# Altium schematic sheet V72单CIS.SchDoc
size A1
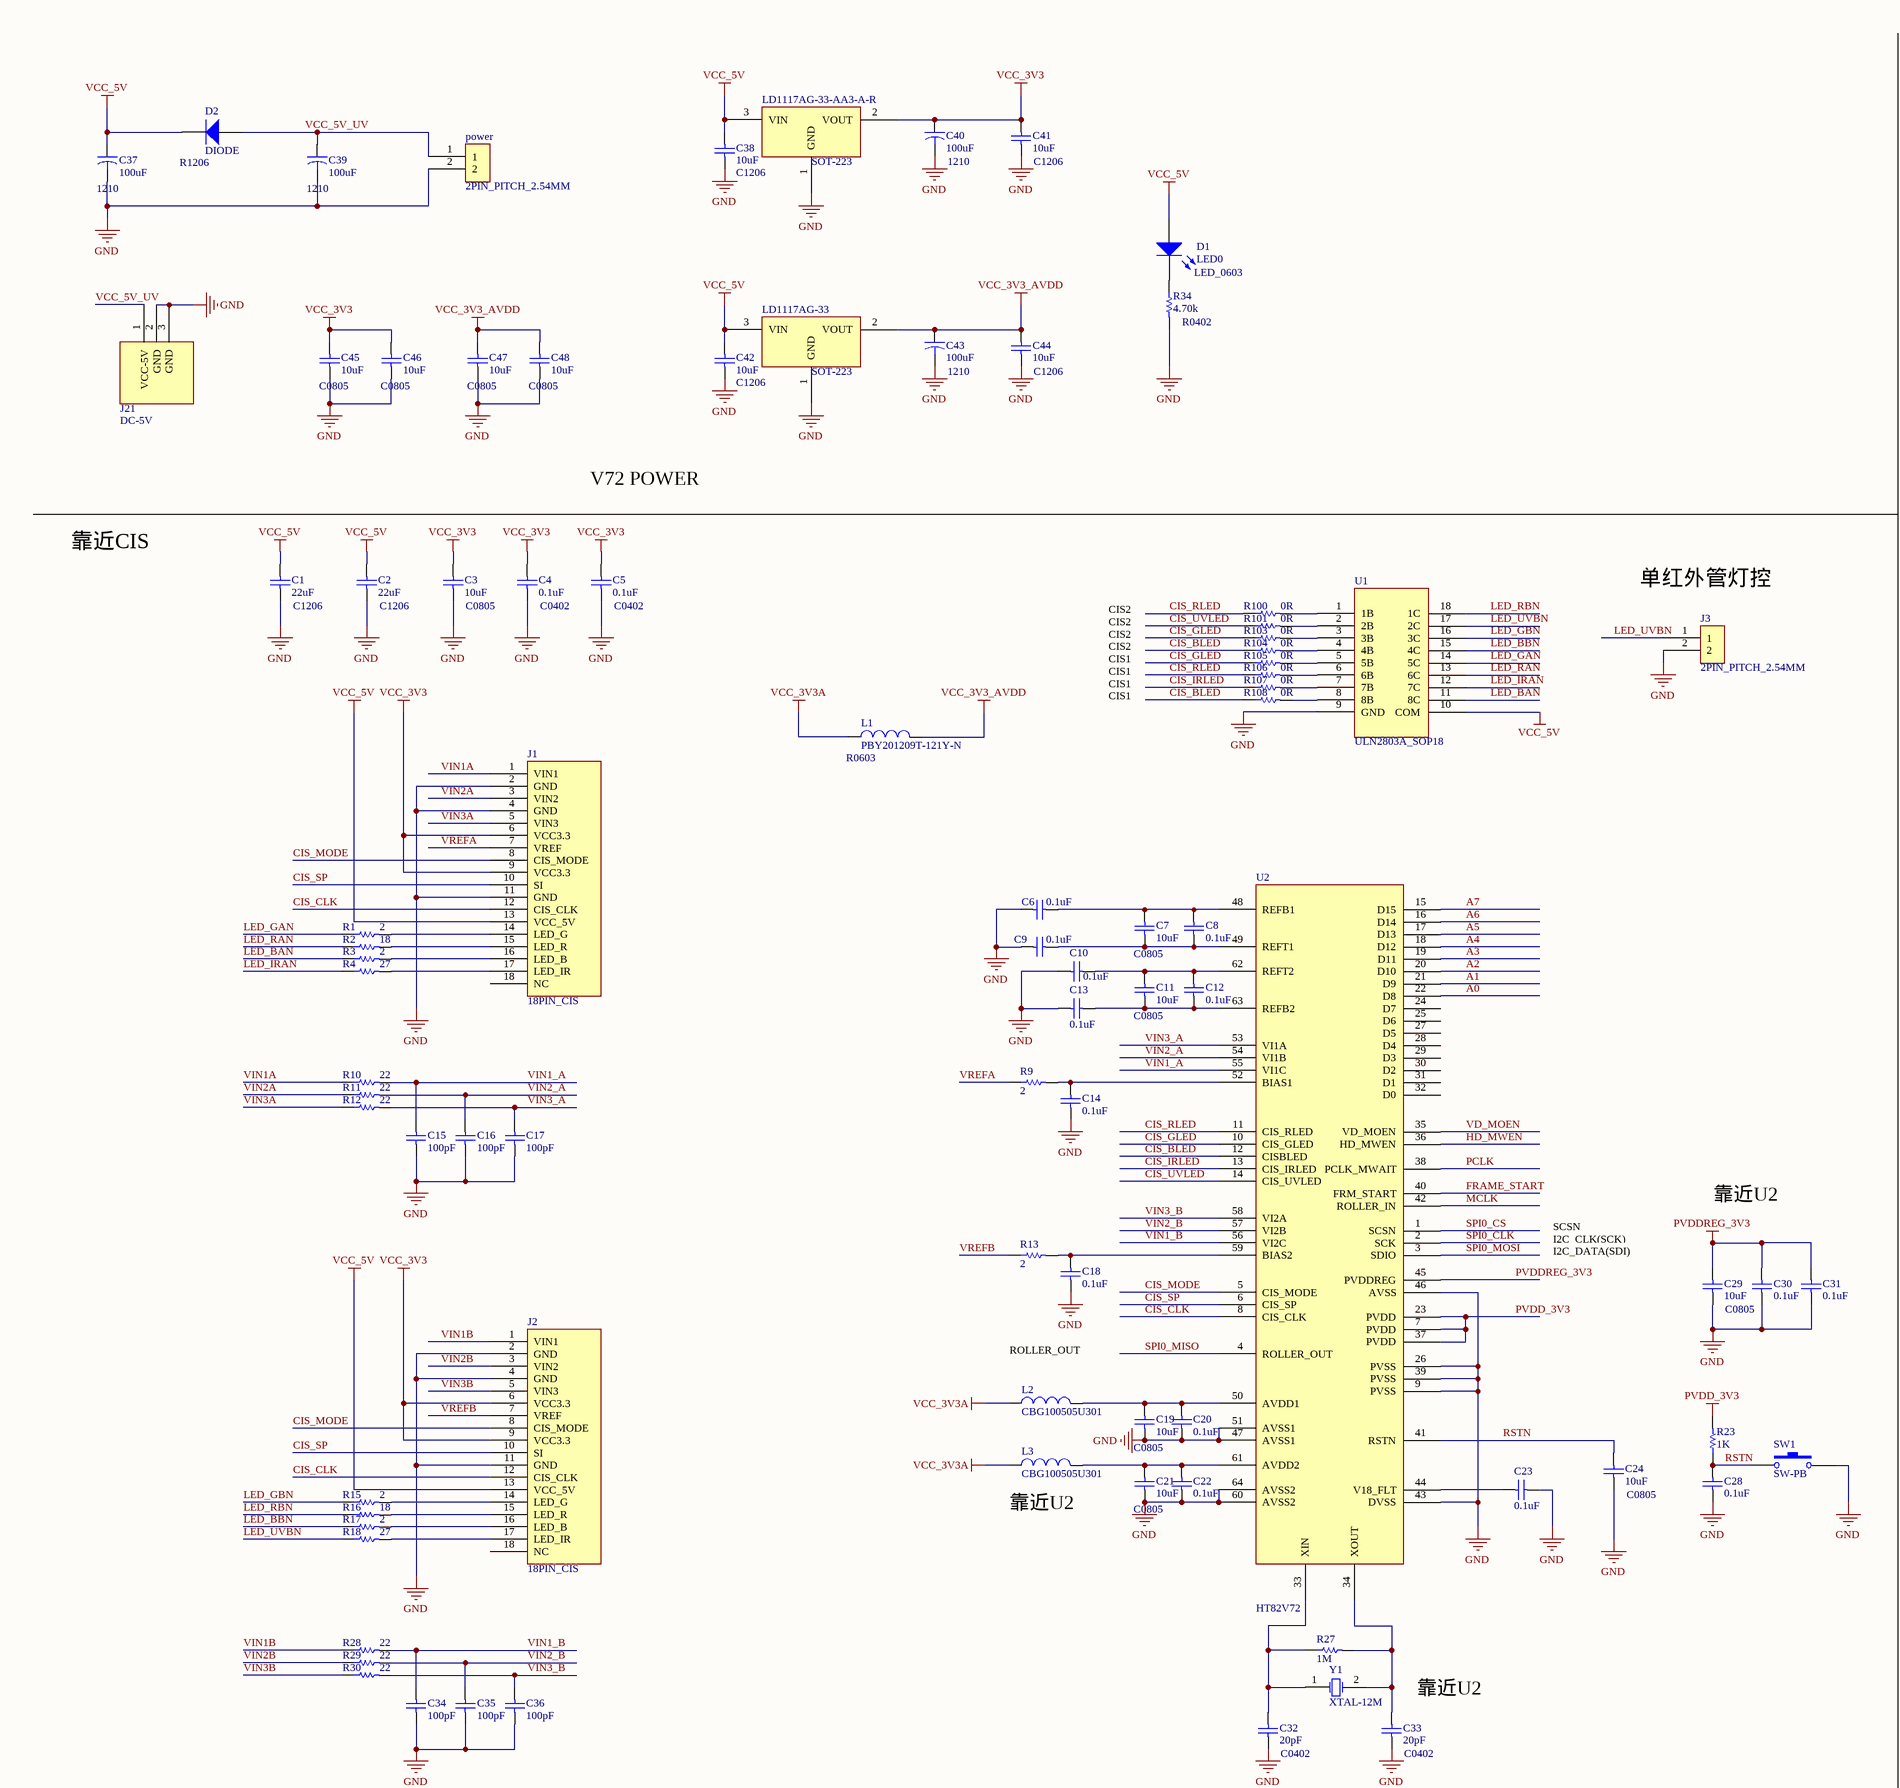
[diagram p0: V72单CIS.SchDoc, top left]
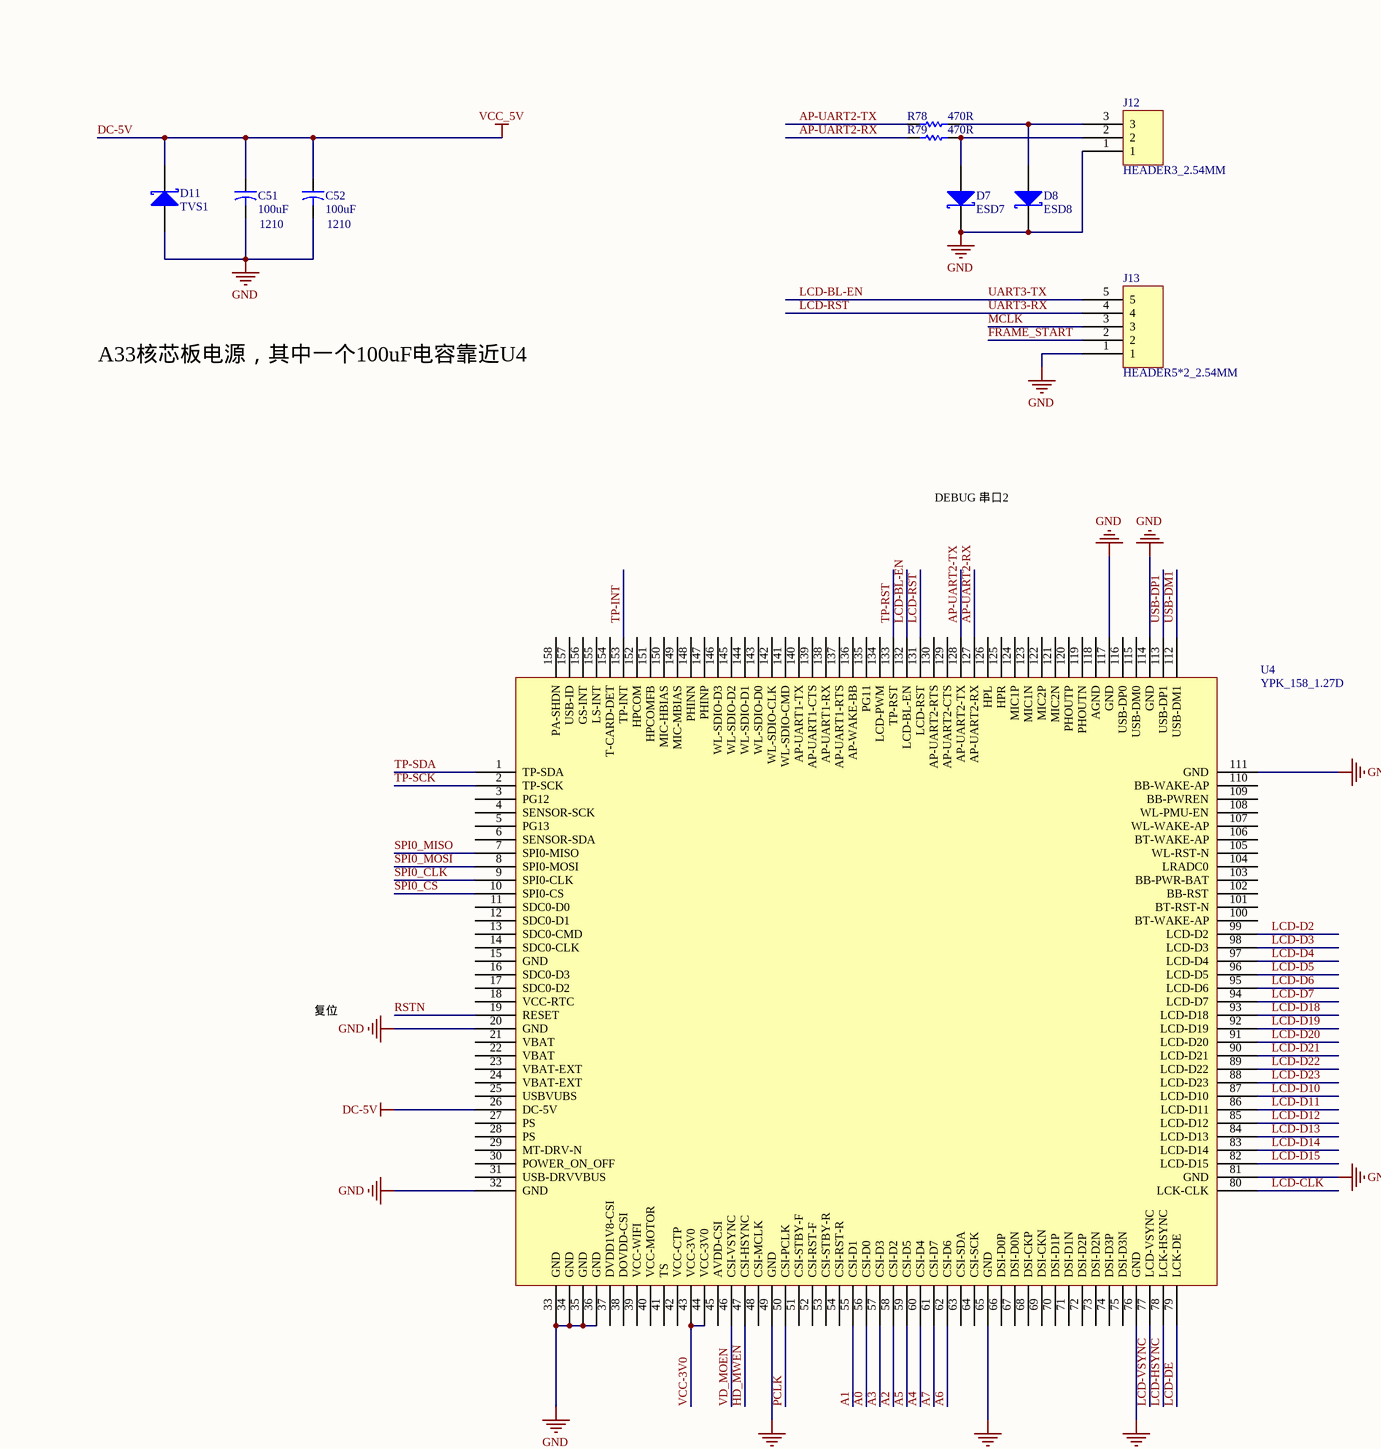
[diagram p1: V72单CIS.SchDoc, top middle]
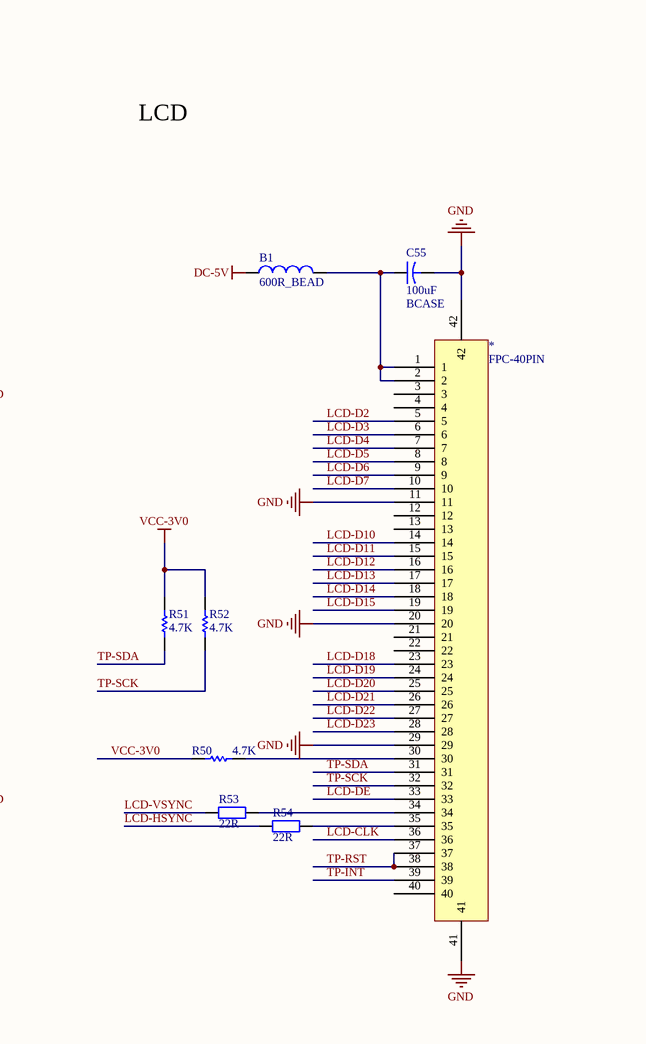
[diagram p2: V72单CIS.SchDoc, top right]
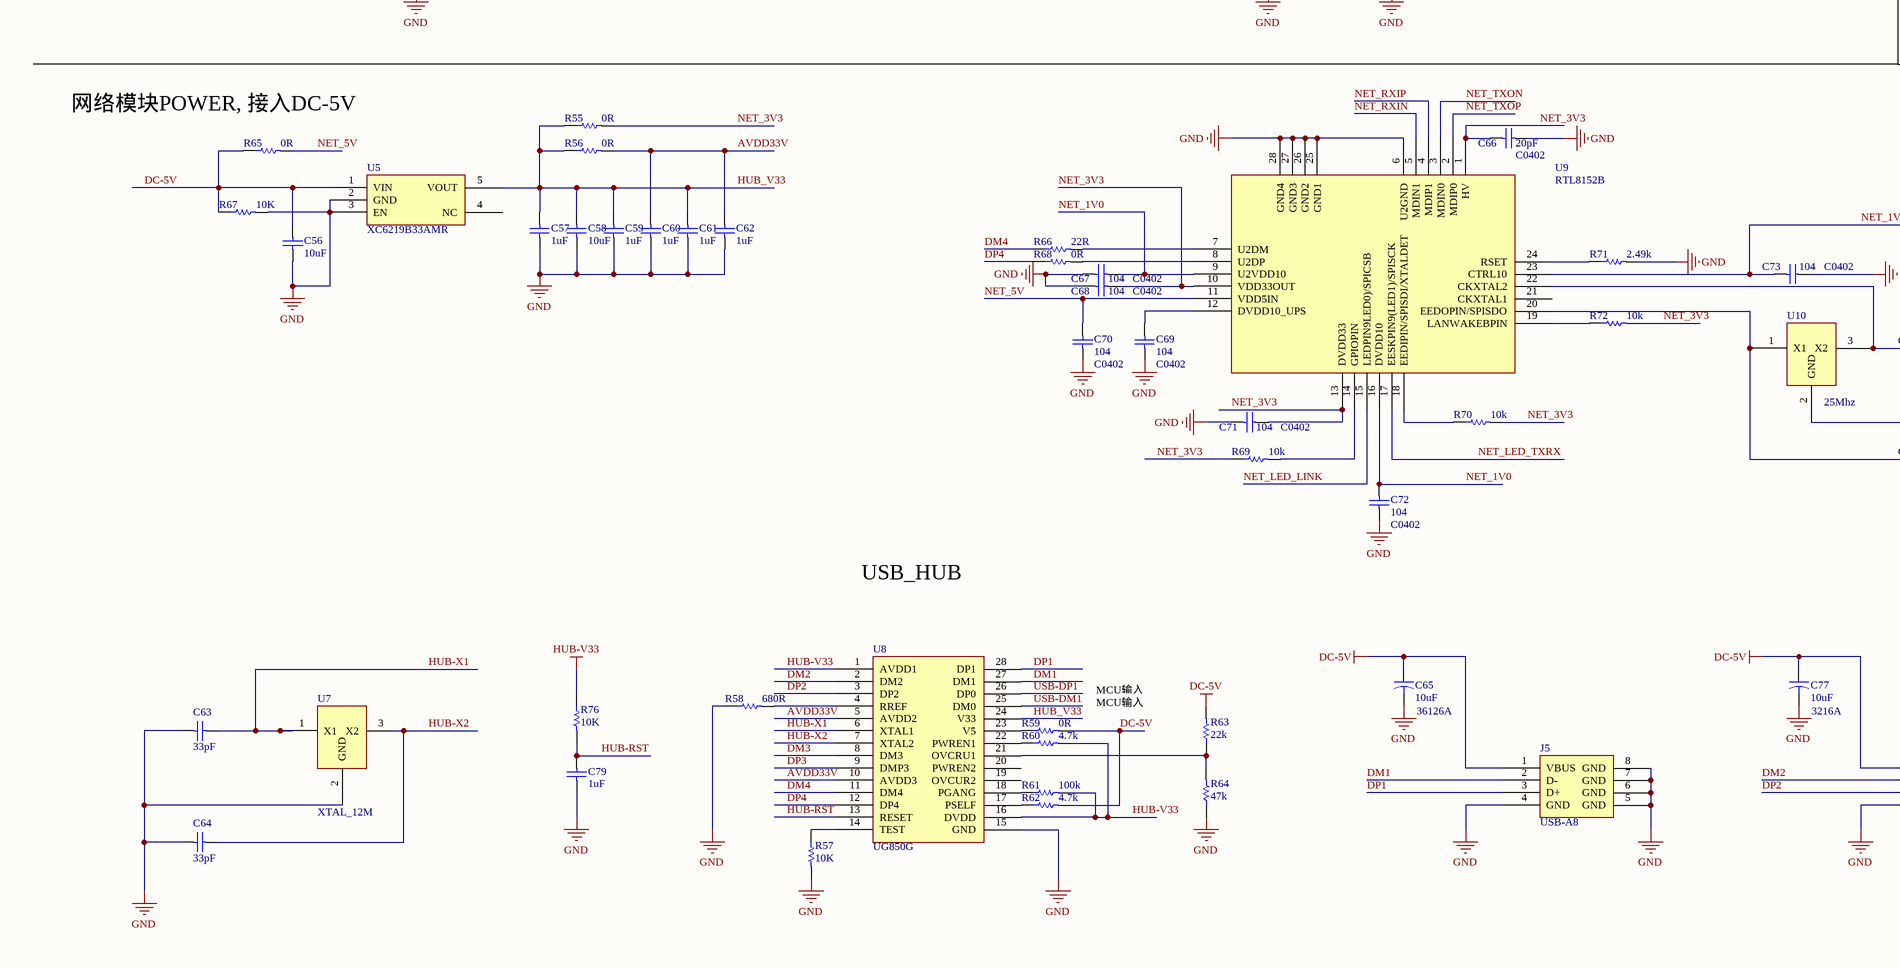
[diagram p3: V72单CIS.SchDoc, bottom left]
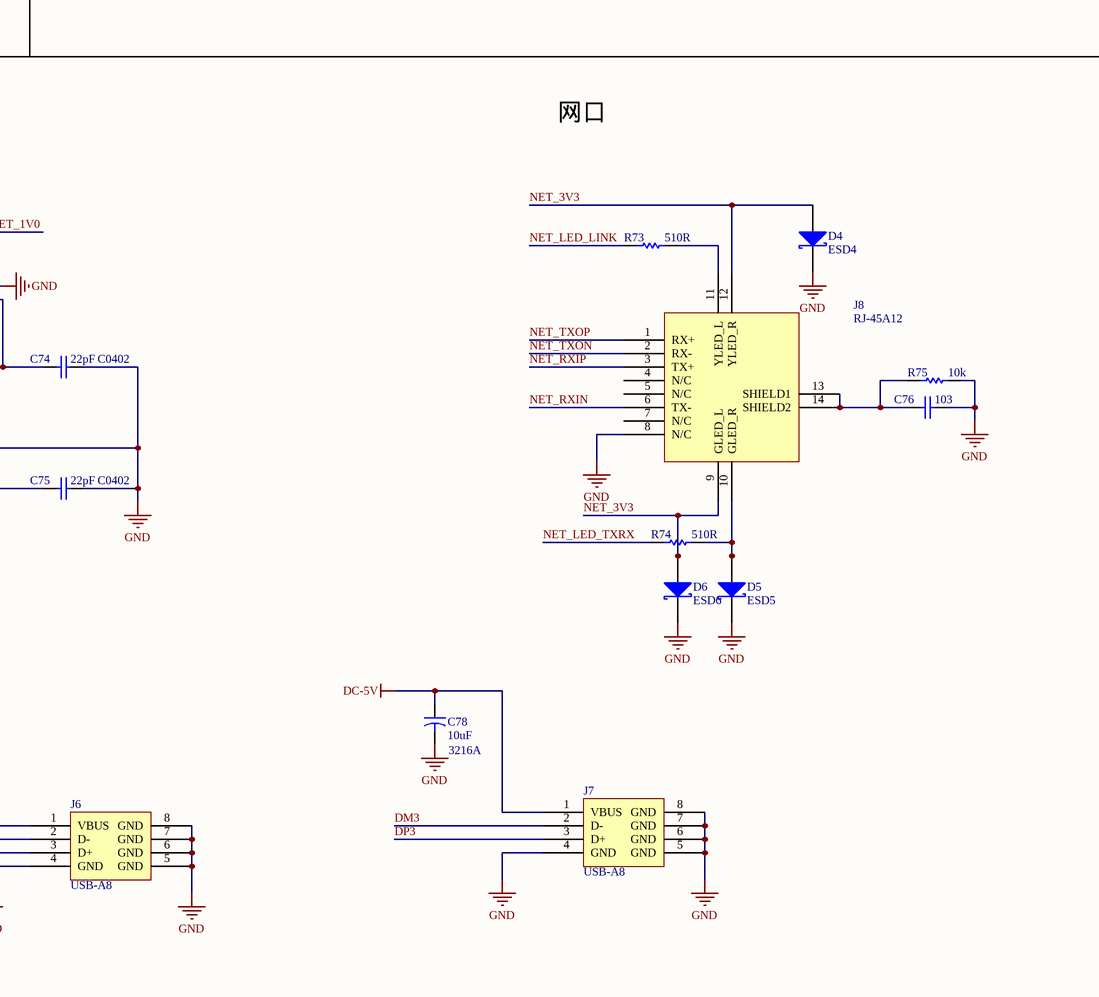
[diagram p4: V72单CIS.SchDoc, bottom middle]

## Parts
*  FPC-40PIN  [FPC-40PIN]
B1  600R_BEAD  [R0603]
C1  22uF  [C1206]
C2  22uF  [C1206]
C3  10uF  [C0805]
C4  0.1uF  [C0402]
C5  0.1uF  [C0402]
C6  0.1uF  [C0402]
C7  10uF  [C0805]
C8  0.1uF  [C0402]
C9  0.1uF  [C0402]
C10  0.1uF  [C0402]
C11  10uF  [C0805]
C12  0.1uF  [C0402]
C13  0.1uF  [C0402]
C14  0.1uF  [C0402]
C15  100pF  [C0402]
C16  100pF  [C0402]
C17  100pF  [C0402]
C18  0.1uF  [C0402]
C19  10uF  [C0805]
C20  0.1uF  [C0402]
C21  10uF  [C0805]
C22  0.1uF  [C0402]
C23  0.1uF  [C0402]
C24  10uF  [C0805]
C28  0.1uF  [C0402]
C29  10uF  [C0805]
C30  0.1uF  [C0402]
C31  0.1uF  [C0402]
C32  20pF  [C0402]
C33  20pF  [C0402]
C34  100pF  [C0402]
C35  100pF  [C0402]
C36  100pF  [C0402]
C37  100uF  [1210]
C38  10uF  [C1206]
C39  100uF  [1210]
C40  100uF  [1210]
C41  10uF  [C1206]
C42  10uF  [C1206]
C43  100uF  [1210]
C44  10uF  [C1206]
C45  10uF  [C0805]
C46  10uF  [C0805]
C47  10uF  [C0805]
C48  10uF  [C0805]
C51  100uF  [1210]
C52  100uF  [1210]
C55  100uF  [BCASE]
C56  10uF  [0603A]
C57  1uF  [0603A]
C58  10uF  [0603A]
C59  1uF  [0603A]
C60  1uF  [0603A]
C61  1uF  [0603A]
C62  1uF  [0603A]
C63  33pF  [0603A]
C64  33pF  [0603A]
C65  10uF  footprint: 36126A  [3126A]
C66  20pF  [C0402]
C67  104  [C0402]
C68  104  [C0402]
C69  104  [C0402]
C70  104  [C0402]
C71  104  [C0402]
C72  104  [C0402]
C73  104  [C0402]
C74  22pF  [C0402]
C75  22pF  [C0402]
C76  103  [C0402]
C77  10uF  footprint: 3216A  [3126A]
C78  10uF  footprint: 3216A  [3126A]
C79  1uF  [0603A]
D1  LED0  [LED_0603]
D2  DIODE  [R1206]
D4  ESD4  [LED_0603]
D5  ESD5  [LED_0603]
D6  ESD6  [LED_0603]
D7  ESD7  [LED_0603]
D8  ESD8  [LED_0603]
D11  TVS1  [SMB]
J1  18PIN_CIS  [18PIN_FPC]
J2  18PIN_CIS  [18PIN_FPC]
J3  2PIN_PITCH_2.54MM  [2PIN_PITCH_2.54MM]
J5  USB-A8  [USB-A8]
J6  USB-A8  [USB-A8]
J7  USB-A8  [USB-A8]
J8  RJ-45A12  [RJ-45A12]
J12  HEADER3_2.54MM  [HEADER3_2.54MM]
J13  HEADER5*2_2.54MM  [HEADER5_2.54MM]
J21  DC-5V  [DC-5V]
L1  PBY201209T-121Y-N  [R0603]
L2  CBG100505U301  [R0603]
L3  CBG100505U301  [R0603]
LD1117AG-33  SOT-223  [SOT-223]
LD1117AG-33-AA3-A-R  SOT-223  [SOT-223]
power  2PIN_PITCH_2.54MM  [2PIN_PITCH_2.54MM]
R1  2  [R0603]
R2  18  [R0603]
R3  2  [R0603]
R4  27  [R0603]
R9  2  [R0603]
R10  22  [R0603]
R11  22  [R0603]
R12  22  [R0603]
R13  2  [R0603]
R15  2  [R0603]
R16  18  [R0603]
R17  2  [R0603]
R18  27  [R0603]
R23  1K  [R0603]
R27  1M  [R0603]
R28  22  [R0603]
R29  22  [R0603]
R30  22  [R0603]
R34  4.70k  [R0402]
R50  4.7K  [R0603]
R51  4.7K  [R0603]
R52  4.7K  [R0603]
R53  22R  [R0603]
R54  22R  [R0603]
R55  0R  [R0603]
R56  0R  [R0603]
R57  10K  [R0603]
R58  680R  [R0603]
R59  0R  [R0603]
R60  4.7k  [R0603]
R61  100k  [R0603]
R62  4.7k  [R0603]
R63  22k  [0603A]
R64  47k  [0603A]
R65  0R  [R0603]
R66  22R  [AXIAL-0.3]
R67  10K  [R0603]
R68  0R  [AXIAL-0.3]
R69  10k  [AXIAL-0.3]
R70  10k  [AXIAL-0.3]
R71  2.49k  [AXIAL-0.3]
R72  10k  [AXIAL-0.3]
R73  510R  [AXIAL-0.3]
R74  510R  [AXIAL-0.3]
R75  10k  [AXIAL-0.3]
R76  10K  [0603A]
R78  470R  [R0603]
R79  470R  [R0603]
R100  0R  [R0603]
R101  0R  [R0603]
R103  0R  [R0603]
R104  0R  [R0603]
R105  0R  [R0603]
R106  0R  [R0603]
R107  0R  [R0603]
R108  0R  [R0603]
SW1  SW-PB  [SWSW-2P-6.5M]
U1  ULN2803A_SOP18  [ULN2803A]
U2  HT82V72  [HT82V72]
U4  YPK_158_1.27D  [YPK_158_1.27D]
U5  XC6219B33AMR  [XC6219B33AMR]
U7  XTAL_12M  [XTAL]
U8  UG850G  [GL850G]
U9  RTL8152B  [RTL8723BS]
U10  25Mhz  [XTAL]
Y1  XTAL-12M  [XTAL8M]

## Nets
DC-5V: B1.1 C1.2 C2.2 C37.1 C38.2 C42.2 C51.1 C52.1 C56.2 C65.1 C77.1 C78.1 D1.1(A) D2.2(K) D11.2(K) J1.13(VCC_5V) J2.13(VCC_5V) J5.1(VBUS) J6.1(VBUS) J7.1(VBUS) LD1117AG-33.3(VIN) LD1117AG-33-AA3-A-R.3(VIN) R59.2 R62.2 R63.2 R65.1 R67.1 U1.10(COM) U4.26(DC-5V) U5.1(VIN)  [also labelled VCC_5V]
GND: *.11 *.20 *.29 *.41 *.42 C1.1 C2.1 C3.1 C4.1 C5.1 C6.2 C9.2 C10.2 C13.2 C14.2 C15.1 C16.1 C17.1 C18.2 C19.1 C20.1 C21.1 C22.1 C23.1 C24.1 C28.2 C29.1 C30.2 C31.2 C32.1 C33.1 C34.1 C35.1 C36.1 C37.2 C38.1 C39.2 C40.2 C41.1 C42.1 C43.2 C44.1 C45.1 C46.1 C47.1 C48.1 C51.2 C52.2 C55.2 C56.1 C57.1 C58.1 C59.1 C60.1 C61.1 C62.1 C63.2 C64.2 C65.2 C66.1 C67.2 C68.2 C69.2 C70.2 C71.2 C72.2 C73.2 C74.2 C75.2 C76.2 C77.2 C78.2 C79.1 D4.3(K) D5.3(K) D6.3(K) D7.3(K) D8.3(K) D11.1(A) J1.2(GND) J1.4(GND) J1.11(GND) J2.2(GND) J2.4(GND) J2.11(GND) J3.2 J5.4(GND) J5.5(GND) J5.6(GND) J5.7(GND) J5.8(GND) J6.4(GND) J6.5(GND) J6.6(GND) J6.7(GND) J6.8(GND) J7.4(GND) J7.5(GND) J7.6(GND) J7.7(GND) J7.8(GND) J8.8(N/C) J12.1 J13.1 J21.2(GND) J21.3(GND) LD1117AG-33.1(GND) LD1117AG-33-AA3-A-R.1(GND) power.2 R34.2 R57.2 R58.1 R64.1 R67.2 R71.2 R75.2 SW1.2 U1.9(GND) U2.9(PVSS) U2.26(PVSS) U2.39(PVSS) U2.43(DVSS) U2.46(AVSS) U2.47(AVSS1) U2.51(AVSS1) U2.60(AVSS2) U2.64(AVSS2) U4.20(GND) U4.32(GND) U4.33(GND) U4.34(GND) U4.35(GND) U4.36(GND) U4.49(GND) U4.65(GND) U4.76(GND) U4.81(GND) U4.111(GND) U4.114(GND) U4.117(GND) U5.2(GND) U5.3(EN) U7.2(GND) U8.15(GND) U9.6(U2GND) U9.25(GND1) U9.26(GND2) U9.27(GND3) U9.28(GND4) U10.2(GND)
HUB-V33: R60.2 R61.2 R76.1 U8.1(AVDD1) U8.16(DVDD)
PVDD_3V3: R23.2 U2.7(PVDD) U2.23(PVDD) U2.37(PVDD)
PVDDREG_3V3: C29.2 C30.1 C31.1 U2.45(PVDDREG)
VCC-3V0: R50.1 R51.1 R52.1 U4.43(VCC-3V0) U4.44(VCC-3V0)
VCC_3V3: C3.2 C4.2 C5.2 C40.1 C41.2 C45.2 C46.2 J1.6(VCC3.3) J1.9(VCC3.3) J2.6(VCC3.3) J2.9(VCC3.3) LD1117AG-33-AA3-A-R.2(VOUT)
VCC_3V3_AVDD: C43.1 C44.2 C47.2 C48.2 L1.2 LD1117AG-33.2(VOUT)
VCC_3V3A: L1.1 L2.1 L3.1
A0: U2.22(D8) U4.56(CSI-D0)
A1: U2.21(D9) U4.55(CSI-D1)
A2: U2.20(D10) U4.58(CSI-D2)
A3: U2.19(D11) U4.57(CSI-D3)
A4: U2.18(D12) U4.60(CSI-D4)
A5: U2.17(D13) U4.59(CSI-D5)
A6: U2.16(D14) U4.62(CSI-D6)
A7: U2.15(D15) U4.61(CSI-D7)
AP-UART2-RX: R79.1 U4.127(AP-UART2-RX)
AP-UART2-TX: R78.1 U4.128(AP-UART2-TX)
AVDD33V: C60.2 C62.2 R56.2 U8.5(AVDD2) U8.10(AVDD3)
CIS_BLED: R104.1 R108.1 U2.12(CISBLED)
CIS_CLK: J1.12(CIS_CLK) J2.12(CIS_CLK) U2.8(CIS_CLK)
CIS_GLED: R103.1 R105.1 U2.10(CIS_GLED)
CIS_IRLED: R107.1 U2.13(CIS_IRLED)
CIS_MODE: J1.8(CIS_MODE) J2.8(CIS_MODE) U2.5(CIS_MODE)
CIS_RLED: R100.1 R106.1 U2.11(CIS_RLED)
CIS_SP: J1.10(SI) J2.10(SI) U2.6(CIS_SP)
CIS_UVLED: R101.1 U2.14(CIS_UVLED)
DM1: J5.2(D-) U8.27(DM1)
DM2: J6.2(D-) U8.2(DM2)
DM3: J7.2(D-) U8.8(DM3)
DM4: R66.1 U8.11(DM4)
DP1: J5.3(D+) U8.28(DP1)
DP2: J6.3(D+) U8.3(DP2)
DP3: J7.3(D+) U8.9(DMP3)
DP4: R68.1 U8.12(DP4)
FRAME_START: J13.2 U2.40(FRM_START)
HD_MWEN: U2.36(HD_MWEN) U4.47(CSI-HSYNC)
HUB-RST: C79.2 R76.2 U8.13(RESET)
HUB-X1: C63.1 U7.1(X1) U8.6(XTAL1)
HUB-X2: C64.1 U7.3(X2) U8.7(XTAL2)
HUB_V33: C57.2 C58.2 C59.2 C61.2 R55.1 R56.1 U5.5(VOUT) U8.24(V33)
LCD-BL-EN: J13.5 U4.132(LCD-BL-EN)  [also labelled UART3-TX]
LCD-CLK: *.36 U4.80(LCK-CLK)
LCD-D2: *.5 U4.99(LCD-D2)
LCD-D3: *.6 U4.98(LCD-D3)
LCD-D4: *.7 U4.97(LCD-D4)
LCD-D5: *.8 U4.96(LCD-D5)
LCD-D6: *.9 U4.95(LCD-D6)
LCD-D7: *.10 U4.94(LCD-D7)
LCD-D10: *.14 U4.87(LCD-D10)
LCD-D11: *.15 U4.86(LCD-D11)
LCD-D12: *.16 U4.85(LCD-D12)
LCD-D13: *.17 U4.84(LCD-D13)
LCD-D14: *.18 U4.83(LCD-D14)
LCD-D15: *.19 U4.82(LCD-D15)
LCD-D18: *.23 U4.93(LCD-D18)
LCD-D19: *.24 U4.92(LCD-D19)
LCD-D20: *.25 U4.91(LCD-D20)
LCD-D21: *.26 U4.90(LCD-D21)
LCD-D22: *.27 U4.89(LCD-D22)
LCD-D23: *.28 U4.88(LCD-D23)
LCD-DE: *.33 U4.79(LCK-DE)
LCD-HSYNC: R54.1 U4.78(LCK-HSYNC)
LCD-RST: J13.4 U4.131(LCD-RST)  [also labelled UART3-RX]
LCD-VSYNC: R53.1 U4.77(LCD-VSYNC)
LED_BAN: R3.1 U1.11(8C)
LED_BBN: R17.1 U1.15(4C)
LED_GAN: R1.1 U1.14(5C)
LED_GBN: R15.1 U1.16(3C)
LED_IRAN: R4.1 U1.12(7C)
LED_RAN: R2.1 U1.13(6C)
LED_RBN: R16.1 U1.18(1C)
LED_UVBN: J3.1 R18.1 U1.17(2C)
MCLK: J13.3 U2.42(ROLLER_IN)
NET_1V0: C67.1 C72.1 C73.1 U9.9(U2VDD10) U9.16(DVDD10) U9.23(CTRL10)
NET_3V3: C66.2 C68.1 C71.1 D4.1(A) D6.1(A) J8.9(GLED_L) J8.12(YLED_R) R55.2 R69.1 R70.2 R72.2 U9.1(HV) U9.10(VDD33OUT) U9.13(DVDD33)
NET_5V: C70.1 R65.2 U9.11(VDD5IN)
NET_LED_LINK: R73.1 U9.15(LEDPIN9LED0)/SPICSB)
NET_LED_TXRX: R74.1 U9.17(EESKPIN9(LED1)/SPISCK)
NET_RXIN: J8.6(TX-) U9.5(MDIN1)
NET_RXIP: J8.3(TX+) U9.4(MDIP1)
NET_TXON: J8.2(RX-) U9.3(MDIN0)
NET_TXOP: J8.1(RX+) U9.2(MDIP0)
PCLK: U2.38(PCLK_MWAIT) U4.50(CSI-PCLK)
RSTN: C24.2 C28.1 R23.1 SW1.1 U2.41(RSTN) U4.19(RESET)
SPI0_CLK: U2.2(SCK) U4.9(SPI0-CLK)
SPI0_CS: U2.1(SCSN) U4.10(SPI0-CS)
SPI0_MISO: U2.4(ROLLER_OUT) U4.7(SPI0-MISO)
SPI0_MOSI: U2.3(SDIO) U4.8(SPI0-MOSI)
TP-INT: *.39 U4.153(TP-INT)
TP-RST: *.37 *.38 U4.133(TP-RST)
TP-SCK: *.32 R52.2 U4.2(TP-SCK)
TP-SDA: *.31 R51.2 U4.1(TP-SDA)
USB-DM1: U4.112(USB-DM1) U8.25(DM0)
USB-DP1: U4.113(USB-DP1) U8.26(DP0)
VCC_5V_UV: C39.1 D2.1(A) J21.1(VCC-5V) power.1
VD_MOEN: U2.35(VD_MOEN) U4.46(CSI-VSYNC)
VIN1_A: C15.2 R10.2 U2.55(VI1C)
VIN1_B: C34.2 R28.2 U2.56(VI2C)
VIN1A: J1.1(VIN1) R10.1
VIN1B: J2.1(VIN1) R28.1
VIN2_A: C16.2 R11.2 U2.54(VI1B)
VIN2_B: C35.2 R29.2 U2.57(VI2B)
VIN2A: J1.3(VIN2) R11.1
VIN2B: J2.3(VIN2) R29.1
VIN3_A: C17.2 R12.2 U2.53(VI1A)
VIN3_B: C36.2 R30.2 U2.58(VI2A)
VIN3A: J1.5(VIN3) R12.1
VIN3B: J2.5(VIN3) R30.1
VREFA: J1.7(VREF) R9.1
VREFB: J2.7(VREF) R13.1
Net*_1: *.1 *.2 B1.2 C55.1
Net*_30: *.30 R50.2
Net*_34: *.34 R53.2
Net*_35: *.35 R54.2
NetC6_1: C6.1 C7.2 C8.1 U2.48(REFB1)
NetC7_1: C7.1 C8.2 C9.1 U2.49(REFT1)
NetC10_1: C10.1 C11.2 C12.1 U2.62(REFT2)
NetC11_1: C11.1 C12.2 C13.1 U2.63(REFB2)
NetC14_1: C14.1 R9.2 U2.52(BIAS1)
NetC18_1: C18.1 R13.2 U2.59(BIAS2)
NetC19_2: C19.2 C20.2 L2.2 U2.50(AVDD1)
NetC21_2: C21.2 C22.2 L3.2 U2.61(AVDD2)
NetC23_2: C23.2 U2.44(V18_FLT)
NetC32_2: C32.2 R27.1 U2.33(XIN) Y1.1(OSC1)
NetC33_2: C33.2 R27.2 U2.34(XOUT) Y1.2(OSC2)
NetC69_1: C69.1 U9.12(DVDD10_UPS)
NetC74_1: C74.1 U9.22(CKXTAL2) U10.3(X2)
NetC75_1: C75.1 U9.20(EEDOPIN/SPISDO) U10.1(X1)
NetC76_1: C76.1 J8.13(SHIELD1) J8.14(SHIELD2) R75.1
NetD1_2: D1.2(K) R34.1
NetD5_1: D5.1(A) J8.10(GLED_R) R74.2
NetD7_1: D7.1(A) J12.2 R79.2
NetD8_1: D8.1(A) J12.3 R78.2
NetJ1_14: J1.14(LED_G) R1.2
NetJ1_15: J1.15(LED_R) R2.2
NetJ1_16: J1.16(LED_B) R3.2
NetJ1_17: J1.17(LED_IR) R4.2
NetJ2_14: J2.14(LED_G) R15.2
NetJ2_15: J2.15(LED_R) R16.2
NetJ2_16: J2.16(LED_B) R17.2
NetJ2_17: J2.17(LED_IR) R18.2
NetJ8_11: J8.11(YLED_L) R73.2
NetR57_1: R57.1 U8.14(TEST)
NetR58_2: R58.2 U8.4(RREF)
NetR59_1: R59.1 U8.23(V5)
NetR60_1: R60.1 U8.22(PWREN1)
NetR61_1: R61.1 U8.18(PGANG)
NetR62_1: R62.1 U8.17(PSELF)
NetR63_1: R63.1 R64.2 U8.21(OVCRU1)
NetR66_2: R66.2 U9.7(U2DM)
NetR68_2: R68.2 U9.8(U2DP)
NetR69_2: R69.2 U9.14(GPIOPIN)
NetR70_1: R70.1 U9.18(EEDIPIN/SPISDI/XTALDET)
NetR71_1: R71.1 U9.24(RSET)
NetR72_1: R72.1 U9.19(LANWAKEBPIN)
NetR100_2: R100.2 U1.1(1B)
NetR101_2: R101.2 U1.2(2B)
NetR103_2: R103.2 U1.3(3B)
NetR104_2: R104.2 U1.4(4B)
NetR105_2: R105.2 U1.5(5B)
NetR106_2: R106.2 U1.6(6B)
NetR107_2: R107.2 U1.7(7B)
NetR108_2: R108.2 U1.8(8B)

Not connected (* = marked no-connect by the designer): * 3 4 12 13 21 22 40; J1 18(NC); J2 18(NC); J8 4(N/C) 5(N/C) 7(N/C); U2 24(D7) 25(D6) 27(D5) 28(D4) 29(D3) 30(D2) 31(D1) 32(D0); U4 3(PG12) 4(SENSOR-SCK) 5(PG13) 6(SENSOR-SDA) 11(SDC0-D0) 12(SDC0-D1) 13(SDC0-CMD) 14(SDC0-CLK) 15(GND) 16(SDC0-D3) 17(SDC0-D2) 18(VCC-RTC) 21(VBAT) 22(VBAT) 23(VBAT-EXT) 24(VBAT-EXT) 25(USBVUBS) 27(PS) 28(PS) 29(MT-DRV-N) 30(POWER_ON_OFF) 31(USB-DRVVBUS) 37(DVDD1V8-CSI) 38(DOVDD-CSI) 39(VCC-WIFI) 40(VCC-MOTOR) 41(TS) 42(VCC-CTP) 45(AVDD-CSI) 48(CSI-MCLK) 51(CSI-STBY-F) 52(CSI-RST-F) 53(CSI-STBY-R) 54(CSI-RST-R) 63(CSI-SDA) 64(CSI-SCK) 66(DSI-D0P) 67(DSI-D0N) 68(DSI-CKP) 69(DSI-CKN) 70(DSI-D1P) 71(DSI-D1N) 72(DSI-D2P) 73(DSI-D2N) 74(DSI-D3P) 75(DSI-D3N) 100(BT-WAKE-AP) 101(BT-RST-N) 102(BB-RST) 103(BB-PWR-BAT) 104(LRADC0) 105(WL-RST-N) 106(BT-WAKE-AP) 107(WL-WAKE-AP) 108(WL-PMU-EN) 109(BB-PWREN) 110(BB-WAKE-AP) 115(USB-DM0) 116(USB-DP0) 118(AGND) 119(PHOUTN) 120(PHOUTP) 121(MIC2N) 122(MIC2P) 123(MIC1N) 124(MIC1P) 125(HPR) 126(HPL) 129(AP-UART2-CTS) 130(AP-UART2-RTS) 134(LCD-PWM) 135(PG11) 136(AP-WAKE-BB) 137(AP-UART1-RTS) 138(AP-UART1-RX) 139(AP-UART1-CTS) 140(AP-UART1-TX) 141(WL-SDIO-CMD) 142(WL-SDIO-CLK) 143(WL-SDIO-D0) 144(WL-SDIO-D1) 145(WL-SDIO-D2) 146(WL-SDIO-D3) 147(PHINP) 148(PHINN) 149(MIC-MBIAS) 150(MIC-HBIAS) 151(HPCOMFB) 152(HPCOM) 154(T-CARD-DET) 155(LS-INT) 156(GS-INT) 157(USB-ID) 158(PA-SHDN); U5 4(NC); U8 19(OVCUR2) 20(PWREN2); U9 21(CKXTAL1)

## Notes on the sheet
- A33核芯板电源，其中一个100uF电容靠近U4
- V72 POWER
- DEBUG 串口2
- 靠近CIS
- CIS2
- (near J3) 单红外管灯控
- LCD
- CIS1
- 复位
- SCSN
- 靠近U2
- I2C_CLK(SCK)
- I2C_DATA(SDI)
- ROLLER_OUT
- (near C33) 靠近U2
- (near R65) 网络模块POWER, 接入DC-5V
- 网口
- USB_HUB
- MCU输入

## Library data of the parts
B1 L2 L3 = Inductor: Code_IEC: 1005; Value: 10mH; Published: 8-Jun-2000; LatestRevisionDate: 29-May-2009; LatestRevisionNote: IPC-7351 Footprint Added.; PackageReference: 0402-A; Publisher: Altium Limited; PackageDescription: Chip Inductor; Code_JEITA: 0402
C1-C14 C18-C24 C28-C33 C41 C44-C48 C56-C64 C66-C76 C79 = Cap: Capacitor; Value: 100pF; Published: 8-Jun-2000; LatestRevisionDate: 17-Jul-2002; LatestRevisionNote: Re-released for DXP Platform.; PackageReference: RAD-0.3; Publisher: Altium Limited; PackageDescription: Radial Cap, Thru-Hole; 2 Leads; 0.3 in Pin Spacing
  C56 C59-C64: footprint: C0805
C15-C17 C34-C36 C38 C42 = Cap: Capacitor; Published: 8-Jun-2000; LatestRevisionDate: 17-Jul-2002; LatestRevisionNote: Re-released for DXP Platform.; Publisher: Altium Limited; PackageDescription: Radial Cap, Thru-Hole; 2 Leads; 0.3 in Pin Spacing
  C15-C17 C34-C36: PackageReference: RAD-0.3; Value: 100pF
  C38 C42: PackageReference: C1206
C37 = Cap2: 电容; Value: 100pF; Published: 23-Sep-2002; PackageReference: CAPR5-4X5; Publisher: Altium Limited; PackageDescription: Capacitor; 2 Leads
C39 C40 C43 C51 C52 C55 C65 C77 C78 = Cap2: Capacitor; Value: 100pF; Published: 23-Sep-2002; PackageReference: CAPR5-4X5; Publisher: Altium Limited; PackageDescription: Capacitor; 2 Leads
D1 = LED0: Typical INFRARED GaAs LED; Published: 8-Jun-2000; LatestRevisionDate: 08-Jul-2005; LatestRevisionNote: Mech Layer 1 removed.; PackageReference: LED-0; Publisher: Altium Limited; PackageDescription: LED; 2 Leads; footpriint: LED_0603
D2 = Diode 1N4149: Computer Diode; Published: 8-Jun-2000; LatestRevisionDate: 17-Jul-2002; LatestRevisionNote: Re-released for DXP Platform.; DatasheetVersion: 1989; PackageVersion: 1989; PackageReference: DO-35A; Publisher: Altium Limited; PackageDescription: Diode, Axial; Body 4.6 x 1.9 mm (LxDia. max), Lead Dia. 0.53 mm (max); Code_JEDEC: DO-204-AH; ComponentLink1Description: Manufacturer Link; ComponentLink1URL: http://www.national.com/
D4-D8 = Diode BAS70: Silicon AF Schottky Diode for High-Speed Switching; Note: Pin 2 is not connected and not drawn.; Published: 21-Mar-2003; LatestRevisionDate: 29-May-2009; LatestRevisionNote: IPC-7351 Footprint Added.; DatasheetVersion: Oct-1999; PackageVersion: Sep-2001; PackageReference: SOT-23; Publisher: Altium Limited; PackageDescription: 3-Pin SOT-23 Package 0.95 mm Pitch, 2.5 mm Lead Span; ComponentLink1Description: Manufacturer Link; ComponentLink1URL: http://www.infineon.com/; ComponentLink2Description: Datasheet; ComponentLink2URL: http://www.infineon.com/upload/Document/cmc_upload/documents/009/382/bas40_bas140series_1.pdf
D11 = D Schottky: TVS二极管5V; Published: 8-Jun-2000; LatestRevisionDate: 17-Jul-2002; LatestRevisionNote: Re-released for DXP Platform.; PackageReference: SMB; Publisher: Altium Limited; PackageDescription: DO-214-AA/SMB; 2 C-Bend Leads; Body 5.3 x 3.6 mm, inc. leads (LxW); Code_JEDEC: DO-214-AA
L1 = Inductor: 电感; Code_IEC: 1005; Value: 10mH; Published: 8-Jun-2000; LatestRevisionDate: 29-May-2009; LatestRevisionNote: IPC-7351 Footprint Added.; PackageReference: 0402-A; Publisher: Altium Limited; PackageDescription: Chip Inductor; Code_JEITA: 0402
LD1117AG-33 LD1117AG-33-AA3-A-R = LD1117S33TR
R1-R4 R9-R13 R15-R18 R27-R30 R34 R50-R52 R55-R76 R78 R79 R100 R101 R103-R108 = Res1: Resistor; Value: 1K; Published: 8-Jun-2000; LatestRevisionDate: 17-Jul-2002; LatestRevisionNote: Re-released for DXP Platform.; PackageReference: AXIAL-0.3; Publisher: Altium Limited; PackageDescription: Axial Device, Thru-Hole; 2 Leads; 0.3 in Pin Spacing
R23 = Res1: Resistor; Published: 8-Jun-2000; LatestRevisionDate: 17-Jul-2002; LatestRevisionNote: Re-released for DXP Platform.; PackageReference: AXIAL-0.3; Publisher: Altium Limited; PackageDescription: Axial Device, Thru-Hole; 2 Leads; 0.3 in Pin Spacing; Value: 1K
R53 R54 = Res2: Resistor; Value: 1K; Published: 8-Jun-2000; LatestRevisionDate: 17-Jul-2002; LatestRevisionNote: Re-released for DXP Platform.; PackageReference: AXIAL-0.4; Publisher: Altium Limited; PackageDescription: Axial Device, Thru-Hole; 2 Leads; 0.4 in Pin Spacing
SW1 = SW-PB: Switch; Published: 24-Mar-1999; LatestRevisionDate: 17-Jul-2002; LatestRevisionNote: Re-released for DXP Platform.; PackageReference: SPST-2; Publisher: Altium Limited; PackageDescription: Switch; 2 Leads
U10 = XTAL_12M
Y1 = XTAL: Crystal Oscillator; Published: 8-Jun-2000; LatestRevisionDate: 17-Jul-2002; LatestRevisionNote: Re-released for DXP Platform.; PackageReference: R38; Publisher: Altium Limited; PackageDescription: Crystal, Thru-Hole; 2 Leads; Body 3.1 x 8.2 mm (Dia.xH)